# Altium schematic sheet top.SchDoc: schematic template
size 420 x 297 mm; Date: 2021-12-08; Author: Joachim Löfwander; Revision: AAA-000; SheetNumber: 1; SheetTotal: 3; Website: github.com/jlofw
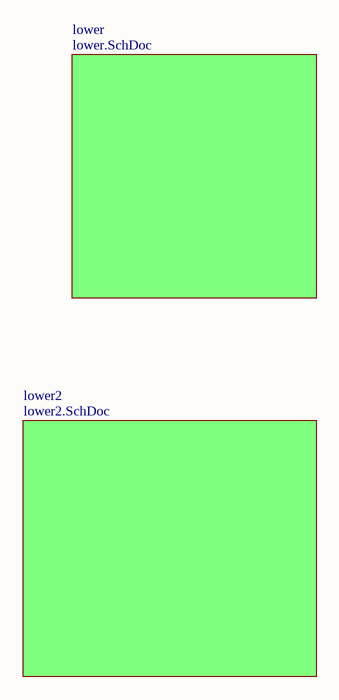
[diagram p0: top.SchDoc]

## Sub-sheets
lower = lower.SchDoc: no entries
lower2 = lower2.SchDoc: no entries

## Notes on the sheet
- PROJECT
- TITLE
- FILE NAME
- DATE MODIFIED
- SHEET
- REV
- OF
- AUTHOR
- WEBSITE